# Altium schematic sheet AMU-S22-V00-CURRENT5kWAlarm.SchDoc: 5kW Alarm
size A3; DrawnBy: Jonn Dillon; DocumentNumber: 10; SheetNumber: 20; SheetTotal: 25; Project: Shutdown Current Board 2020
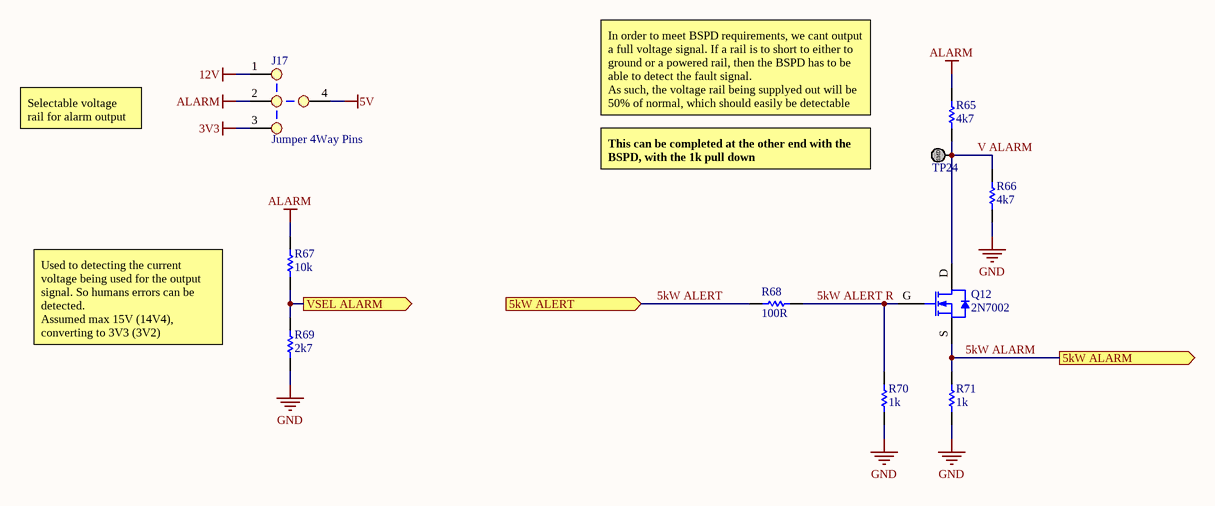
[diagram p0: AMU-S22-V00-CURRENT5kWAlarm.SchDoc]

## Parts
J17  Jumper 4Way Pins  [Jumper_4Way_Pin]
Q12  2N7002  [SOT23-3]
R65  4k7  [Res_ThinFilm_0603]
R66  4k7  [Res_ThinFilm_0603]
R67  10k  [Res_ThinFilm_0603]
R68  100R  [Res_ThinFilm_0603]
R69  2k7  [Res_ThinFilm_0603]
R70  1k  [Res_ThinFilm_0603]
R71  1k  [Res_ThinFilm_0603]
TP24  TestPoint_SMD  [TestPointSMD]  (value not drawn)

## Ports
5kW ALARM (out), 5kW ALERT (in), VSEL ALARM (out)

## Nets
3V3: J17.3
5V: J17.4
12V: J17.1
ALARM: J17.2 R65.2 R67.2
GND: R66.1 R69.1 R70.1 R71.1
5kW ALARM: Q12.S R71.2 ; port 5kW ALARM
5kW ALERT: R68.1 ; port 5kW ALERT
5kW ALERT R: Q12.G R68.2 R70.2
V ALARM: Q12.D R65.1 R66.2 TP24.1
VSEL ALARM: R67.1 R69.2 ; port VSEL ALARM

## Notes on the sheet
- In order to meet BSPD requirements, we cant output a full voltage signal. If a rail is to short to either to ground or a powered rail, then the BSPD has to be able to detect the fault signal.
  As such, the voltage rail being supplyed out will be 50% of normal, which should easily be detectable
- Selectable voltage rail for alarm output
- This can be completed at the other end with the BSPD, with the 1k pull down
- Used to detecting the current voltage being used for the output signal. So humans errors can be detected.
  Assumed max 15V (14V4), converting to 3V3 (3V2)
- Revision History:
- Sheet Title:
- Rev
- Date
- Description
- Project:
- Size:
- Drawn By:
- A3
- Number:
- Revision:
- Sheet
- Version:
- of
- QUT Motorsport
- O-120, Gardens Point
- 2 George Street
- Brisbane, QLD 4000
- Australia
- Print Date:
- Print Time:
- File Name:
- (in symbol TestPoint_SMD) SMD

## Library data of the parts
R65 R66 = 4k7 5% 0603: Resistor, SMD, 4k7, 0.1W, 5%, 0603
R67 = 10k 5% 0603: Resistor, SMD, 10k, 0.1W, 5%, 0603
R68 = 100R 5%, 0603: Resistor, SMD, 100R, 0.1W, 5%, 0603
R69 = 2k7 5% 0603: Resistor, SMD, 2k7, 0.1W, 5%, 0603
R70 R71 = 1k 5% 0603: Resistor, SMD, 1k, 0.1W, 5%, 0603